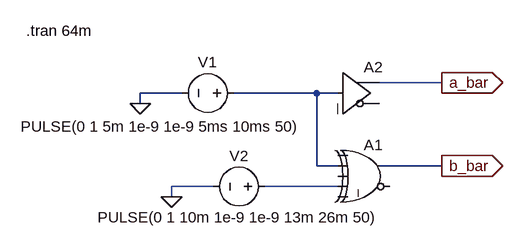
[diagram p0: schematic CNOT.asc]
CNOT.asc, the LTspice schematic file:
Version 4
SHEET 1 880 680
WIRE 192 48 96 48
WIRE -208 64 -272 64
WIRE 0 64 -128 64
WIRE 32 64 0 64
WIRE -272 80 -272 64
WIRE 0 176 0 64
WIRE 32 176 0 176
WIRE 192 176 96 176
WIRE 192 192 192 176
WIRE -160 208 -224 208
WIRE 32 208 -80 208
WIRE -224 224 -224 208
FLAG -272 80 0
FLAG -224 224 0
FLAG 192 48 a_bar
IOPIN 192 48 Out
FLAG 192 176 b_bar
IOPIN 192 176 Out
SYMBOL Digital\\xor 80 128 R0
SYMATTR InstName A1
SYMBOL Digital\\buf 32 0 R0
SYMATTR InstName A2
SYMBOL voltage -112 64 R90
WINDOW 0 -32 56 VBottom 2
WINDOW 3 36 128 VTop 2
WINDOW 123 0 0 Left 0
WINDOW 39 0 0 Left 0
SYMATTR InstName V1
SYMATTR Value PULSE(0 1 5m 1e-9 1e-9 5ms 10ms 50)
SYMBOL voltage -64 208 R90
WINDOW 0 -32 56 VBottom 2
WINDOW 3 32 56 VTop 2
WINDOW 123 0 0 Left 0
WINDOW 39 0 0 Left 0
SYMATTR InstName V2
SYMATTR Value PULSE(0 1 10m 1e-9 1e-9 13m 26m 50)
TEXT -448 -32 Left 2 !.tran 64m

The netlist it stands for:
* CNOT.asc
A1 0 N001 0 N002 0 0 b_bar 0 XOR
A2 N001 0 0 0 0 0 a_bar 0 BUF
V1 N001 0 PULSE(0 1 5m 1e-9 1e-9 5ms 10ms 50)
V2 N002 0 PULSE(0 1 10m 1e-9 1e-9 13m 26m 50)
.tran 64m
.backanno
.end